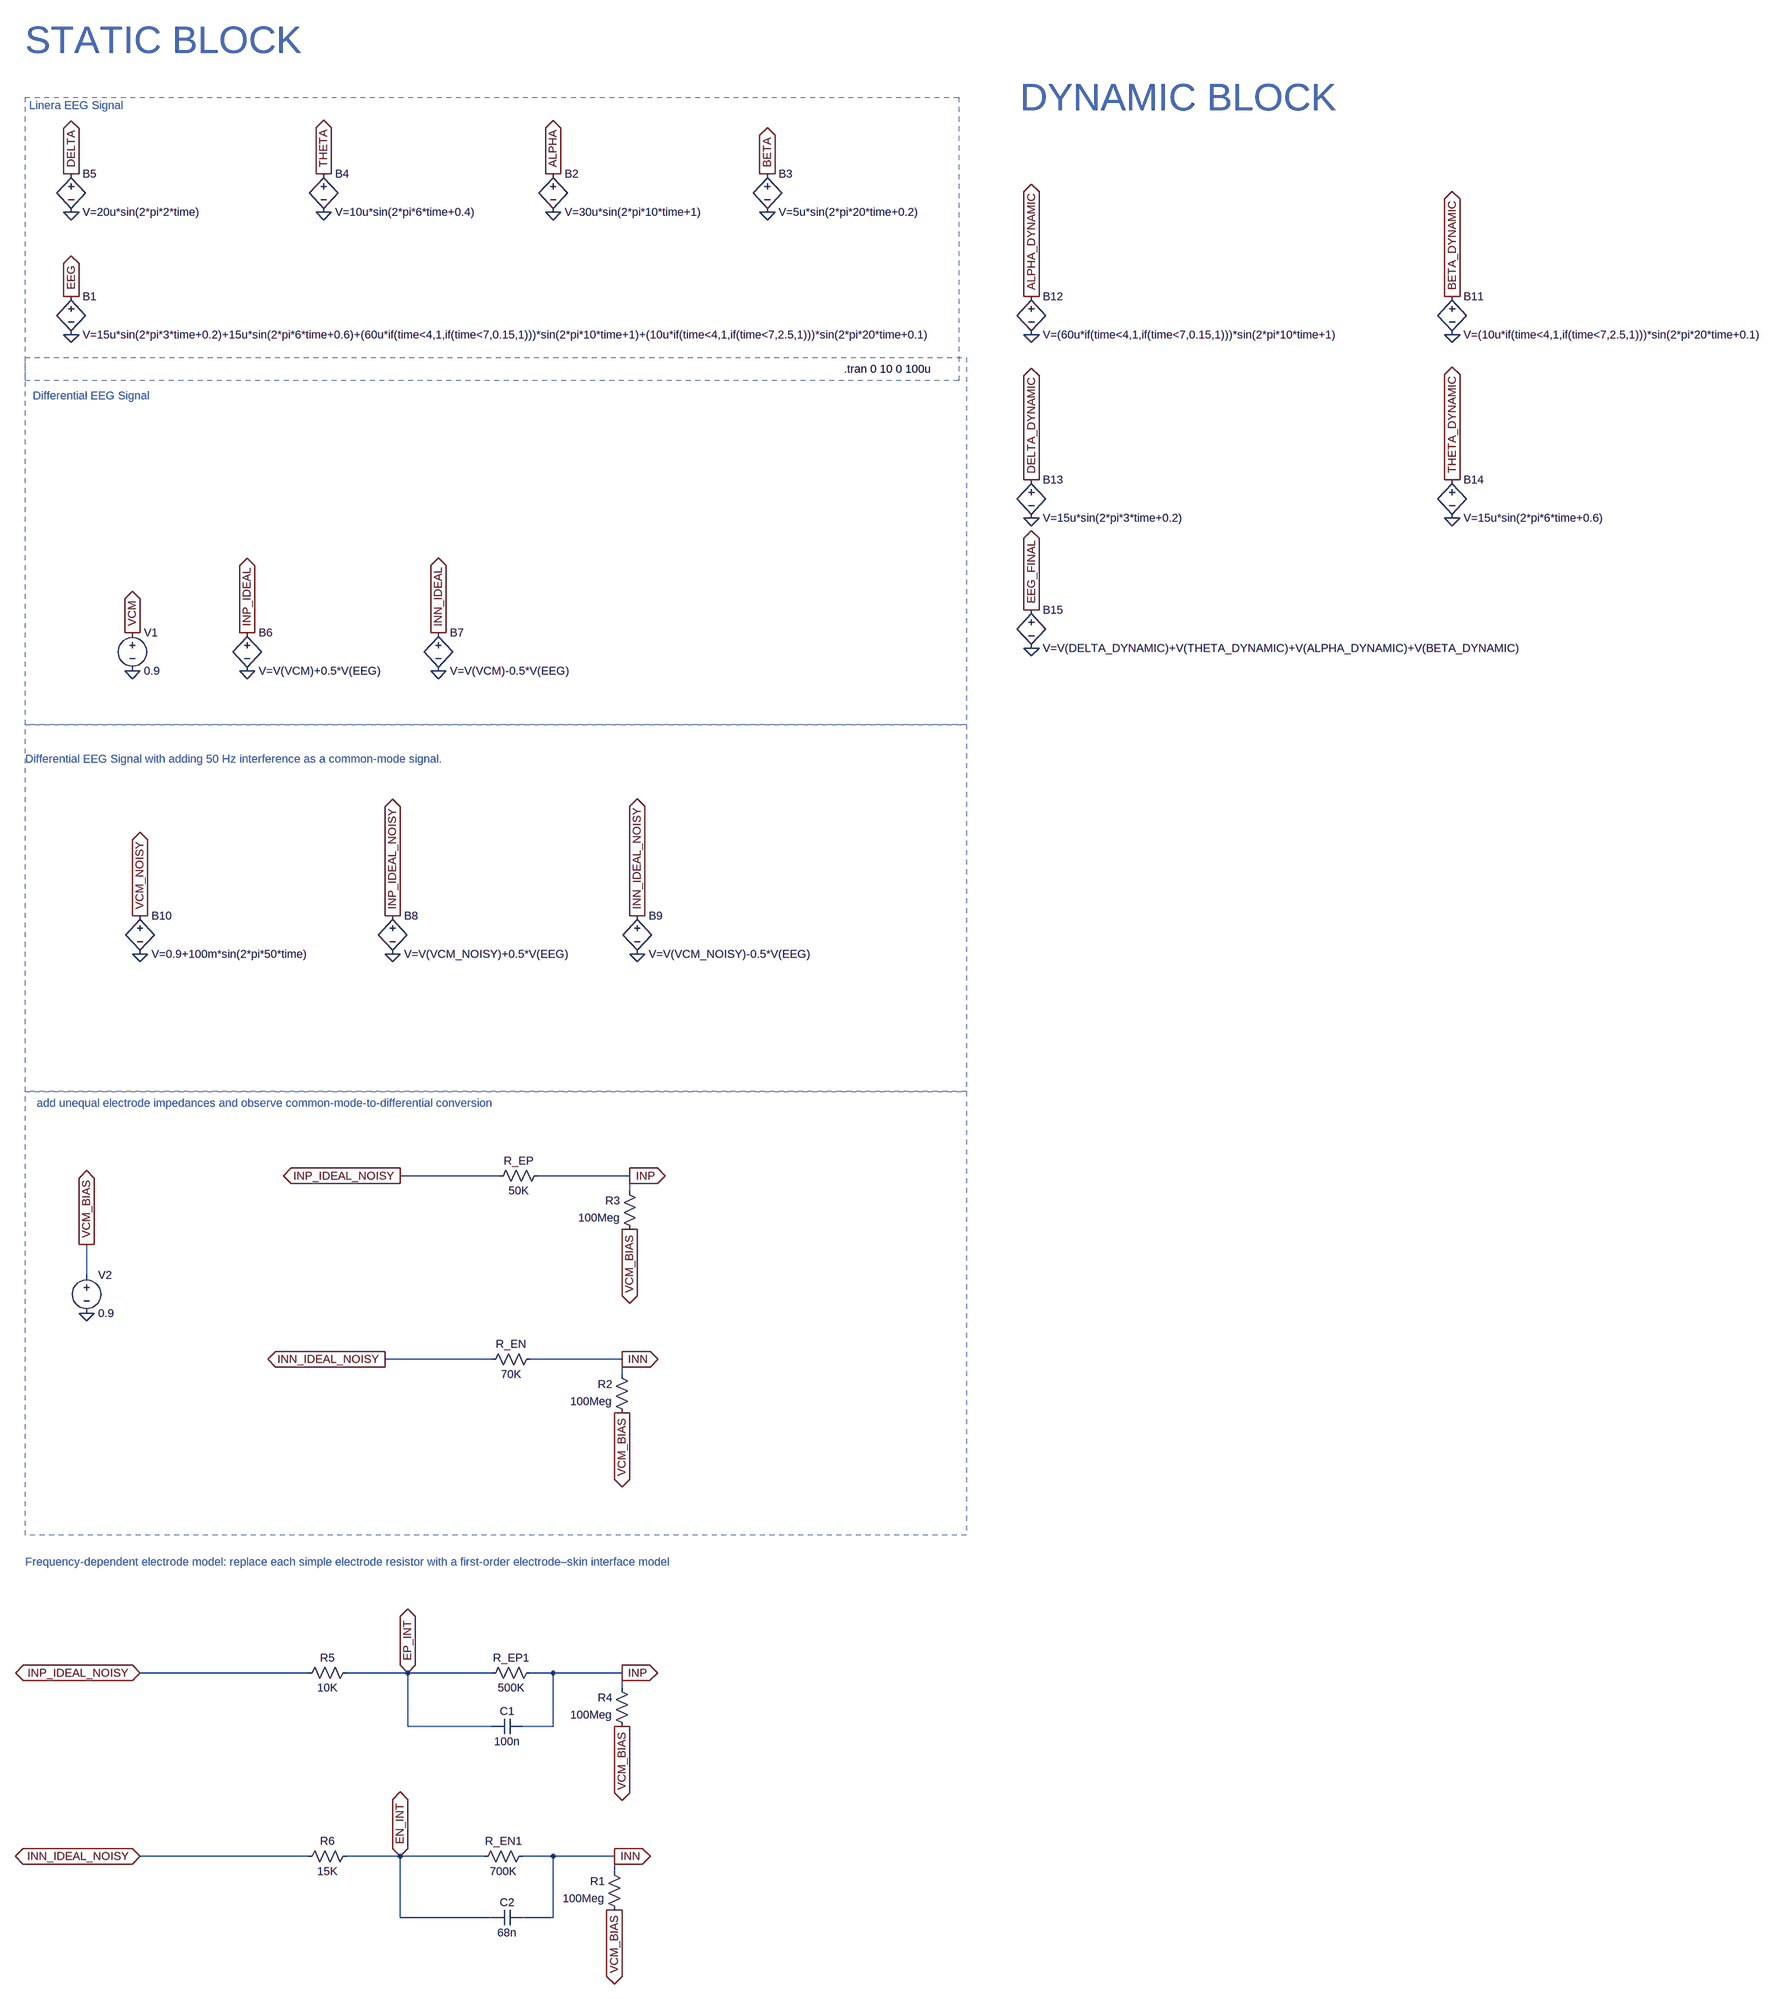
[diagram p0: schematic EEG_signal_generator.asc]
EEG_signal_generator.asc, the LTspice schematic file:
Version 4.1
SHEET 1 4440 3752
WIRE 80 2032 -128 2032
WIRE 352 2032 160 2032
WIRE 352 2064 352 2032
WIRE -784 2240 -784 2176
WIRE 64 2416 -160 2416
WIRE 336 2416 144 2416
WIRE 336 2448 336 2416
WIRE -320 3072 -672 3072
WIRE -112 3072 -240 3072
WIRE 64 3072 -112 3072
WIRE 192 3072 144 3072
WIRE 336 3072 192 3072
WIRE 336 3104 336 3072
WIRE -112 3184 -112 3072
WIRE 64 3184 -112 3184
WIRE 192 3184 192 3072
WIRE 192 3184 128 3184
WIRE -320 3456 -672 3456
WIRE -128 3456 -240 3456
WIRE 48 3456 -128 3456
WIRE 192 3456 128 3456
WIRE 320 3456 192 3456
WIRE 320 3488 320 3456
WIRE -128 3584 -128 3456
WIRE 64 3584 -128 3584
WIRE 192 3584 192 3456
WIRE 192 3584 128 3584
FLAG -816 272 0
FLAG -816 192 EEG
IOPIN -816 192 Out
FLAG 192 16 0
FLAG 192 -64 ALPHA
IOPIN 192 -64 Out
FLAG 640 16 0
FLAG 640 -64 BETA
IOPIN 640 -64 Out
FLAG -288 16 0
FLAG -288 -64 THETA
IOPIN -288 -64 Out
FLAG -816 16 0
FLAG -816 -64 DELTA
IOPIN -816 -64 Out
FLAG -688 976 0
FLAG -688 896 VCM
IOPIN -688 896 Out
FLAG -448 976 0
FLAG -448 896 INP_IDEAL
IOPIN -448 896 Out
FLAG -48 976 0
FLAG -48 896 INN_IDEAL
IOPIN -48 896 Out
FLAG -144 1568 0
FLAG -144 1488 INP_IDEAL_NOISY
IOPIN -144 1488 Out
FLAG 368 1568 0
FLAG 368 1488 INN_IDEAL_NOISY
IOPIN 368 1488 Out
FLAG -672 1568 0
FLAG -672 1488 VCM_NOISY
IOPIN -672 1488 Out
FLAG -128 2032 INP_IDEAL_NOISY
IOPIN -128 2032 Out
FLAG -160 2416 INN_IDEAL_NOISY
IOPIN -160 2416 Out
FLAG -784 2320 0
FLAG -784 2176 VCM_BIAS
IOPIN -784 2176 Out
FLAG 352 2032 INP
IOPIN 352 2032 Out
FLAG 336 2416 INN
IOPIN 336 2416 Out
FLAG 352 2144 VCM_BIAS
IOPIN 352 2144 Out
FLAG 336 2528 VCM_BIAS
IOPIN 336 2528 Out
FLAG -672 3072 INP_IDEAL_NOISY
IOPIN -672 3072 BiDir
FLAG -672 3456 INN_IDEAL_NOISY
IOPIN -672 3456 BiDir
FLAG 336 3072 INP
IOPIN 336 3072 Out
FLAG 320 3456 INN
IOPIN 320 3456 Out
FLAG 336 3184 VCM_BIAS
IOPIN 336 3184 Out
FLAG 320 3568 VCM_BIAS
IOPIN 320 3568 Out
FLAG -112 3072 EP_INT
IOPIN -112 3072 BiDir
FLAG -128 3456 EN_INT
IOPIN -128 3456 BiDir
FLAG 2304 272 0
FLAG 2304 192 ALPHA_DYNAMIC
IOPIN 2304 192 Out
FLAG 3184 272 0
FLAG 3184 192 BETA_DYNAMIC
IOPIN 3184 192 Out
FLAG 2304 656 0
FLAG 2304 576 DELTA_DYNAMIC
IOPIN 2304 576 Out
FLAG 3184 656 0
FLAG 3184 576 THETA_DYNAMIC
IOPIN 3184 576 Out
FLAG 2304 928 0
FLAG 2304 848 EEG_FINAL
IOPIN 2304 848 Out
SYMBOL bv -816 176 R0
SYMATTR InstName B1
SYMATTR Value V=15u*sin(2*pi*3*time+0.2)+15u*sin(2*pi*6*time+0.6)+(60u*if(time<4,1,if(time<7,0.15,1)))*sin(2*pi*10*time+1)+(10u*if(time<4,1,if(time<7,2.5,1)))*sin(2*pi*20*time+0.1)
SYMBOL bv 192 -80 R0
SYMATTR InstName B2
SYMATTR Value V=30u*sin(2*pi*10*time+1)
SYMBOL bv 640 -80 R0
SYMATTR InstName B3
SYMATTR Value V=5u*sin(2*pi*20*time+0.2)
SYMBOL bv -288 -80 R0
SYMATTR InstName B4
SYMATTR Value V=10u*sin(2*pi*6*time+0.4)
SYMBOL bv -816 -80 R0
SYMATTR InstName B5
SYMATTR Value V=20u*sin(2*pi*2*time)
SYMBOL voltage -688 880 R0
WINDOW 123 0 0 Left 0
WINDOW 39 0 0 Left 0
SYMATTR InstName V1
SYMATTR Value 0.9
SYMBOL bv -448 880 R0
SYMATTR InstName B6
SYMATTR Value V=V(VCM)+0.5*V(EEG)
SYMBOL bv -48 880 R0
SYMATTR InstName B7
SYMATTR Value V=V(VCM)-0.5*V(EEG)
SYMBOL bv -144 1472 R0
SYMATTR InstName B8
SYMATTR Value V=V(VCM_NOISY)+0.5*V(EEG)
SYMBOL bv 368 1472 R0
SYMATTR InstName B9
SYMATTR Value V=V(VCM_NOISY)-0.5*V(EEG)
SYMBOL bv -672 1472 R0
SYMATTR InstName B10
SYMATTR Value V=0.9+100m*sin(2*pi*50*time)
SYMBOL res 176 2016 R90
WINDOW 0 0 56 VBottom 2
WINDOW 3 32 56 VTop 2
SYMATTR InstName R_EP
SYMATTR Value 50K
SYMBOL res 160 2400 R90
WINDOW 0 0 56 VBottom 2
WINDOW 3 32 56 VTop 2
SYMATTR InstName R_EN
SYMATTR Value 70K
SYMBOL voltage -784 2224 R0
WINDOW 123 0 0 Left 0
WINDOW 39 0 0 Left 0
SYMATTR InstName V2
SYMATTR Value 0.9
SYMBOL res 352 2544 R180
WINDOW 0 36 76 Left 2
WINDOW 3 36 40 Left 2
SYMATTR InstName R2
SYMATTR Value 100Meg
SYMBOL res 368 2160 R180
WINDOW 0 36 76 Left 2
WINDOW 3 36 40 Left 2
SYMATTR InstName R3
SYMATTR Value 100Meg
SYMBOL res 160 3056 R90
WINDOW 0 0 56 VBottom 2
WINDOW 3 32 56 VTop 2
SYMATTR InstName R_EP1
SYMATTR Value 500K
SYMBOL res 144 3440 R90
WINDOW 0 0 56 VBottom 2
WINDOW 3 32 56 VTop 2
SYMATTR InstName R_EN1
SYMATTR Value 700K
SYMBOL res 336 3584 R180
WINDOW 0 36 76 Left 2
WINDOW 3 36 40 Left 2
SYMATTR InstName R1
SYMATTR Value 100Meg
SYMBOL res 352 3200 R180
WINDOW 0 36 76 Left 2
WINDOW 3 36 40 Left 2
SYMATTR InstName R4
SYMATTR Value 100Meg
SYMBOL res -224 3056 R90
WINDOW 0 0 56 VBottom 2
WINDOW 3 32 56 VTop 2
SYMATTR InstName R5
SYMATTR Value 10K
SYMBOL res -224 3440 R90
WINDOW 0 0 56 VBottom 2
WINDOW 3 32 56 VTop 2
SYMATTR InstName R6
SYMATTR Value 15K
SYMBOL cap 128 3168 R90
WINDOW 0 0 32 VBottom 2
WINDOW 3 32 32 VTop 2
SYMATTR InstName C1
SYMATTR Value 100n
SYMBOL cap 128 3568 R90
WINDOW 0 0 32 VBottom 2
WINDOW 3 32 32 VTop 2
SYMATTR InstName C2
SYMATTR Value 68n
SYMBOL bv 2304 176 R0
SYMATTR InstName B12
SYMATTR Value V=(60u*if(time<4,1,if(time<7,0.15,1)))*sin(2*pi*10*time+1)
SYMBOL bv 3184 176 R0
SYMATTR InstName B11
SYMATTR Value V=(10u*if(time<4,1,if(time<7,2.5,1)))*sin(2*pi*20*time+0.1)
SYMBOL bv 2304 560 R0
SYMATTR InstName B13
SYMATTR Value V=15u*sin(2*pi*3*time+0.2)
SYMBOL bv 3184 560 R0
SYMATTR InstName B14
SYMATTR Value V=15u*sin(2*pi*6*time+0.6)
SYMBOL bv 2304 832 R0
SYMATTR InstName B15
SYMATTR Value V=V(DELTA_DYNAMIC)+V(THETA_DYNAMIC)+V(ALPHA_DYNAMIC)+V(BETA_DYNAMIC)
TEXT 800 344 Left 2 !.tran 0 10 0 100u
TEXT -904 -208 Left 2 ;Linera EEG Signal
TEXT -896 400 Left 2 ;Differential EEG Signal
TEXT -912 1160 Left 2 ;Differential EEG Signal with adding 50 Hz interference as a common-mode signal.
TEXT -888 1880 Left 2 ;add unequal electrode impedances and observe common-mode-to-differential conversion
TEXT -912 2840 Left 2 ;Frequency-dependent electrode model: replace each simple electrode resistor with a first-order electrode–skin interface model
TEXT 2280 -224 Left 6 ;DYNAMIC BLOCK
TEXT -912 -344 Left 6 ;STATIC BLOCK
RECTANGLE Normal 1040 368 -912 -224 2
RECTANGLE Normal 1056 1088 -912 320 2
RECTANGLE Normal 1056 1856 -912 1088 2
RECTANGLE Normal 1056 2784 -912 1856 2

The netlist it stands for:
* EEG_signal_generator.asc
B1 EEG 0 V=15u*sin(2*pi*3*time+0.2)+15u*sin(2*pi*6*time+0.6)+(60u*if(time<4,1,if(time<7,0.15,1)))*sin(2*pi*10*time+1)+(10u*if(time<4,1,if(time<7,2.5,1)))*sin(2*pi*20*time+0.1)
B2 ALPHA 0 V=30u*sin(2*pi*10*time+1)
B3 BETA 0 V=5u*sin(2*pi*20*time+0.2)
B4 THETA 0 V=10u*sin(2*pi*6*time+0.4)
B5 DELTA 0 V=20u*sin(2*pi*2*time)
V1 VCM 0 0.9
B6 INP_IDEAL 0 V=V(VCM)+0.5*V(EEG)
B7 INN_IDEAL 0 V=V(VCM)-0.5*V(EEG)
B8 INP_IDEAL_NOISY 0 V=V(VCM_NOISY)+0.5*V(EEG)
B9 INN_IDEAL_NOISY 0 V=V(VCM_NOISY)-0.5*V(EEG)
B10 VCM_NOISY 0 V=0.9+100m*sin(2*pi*50*time)
R_EP INP INP_IDEAL_NOISY 50K
R_EN INN INN_IDEAL_NOISY 70K
V2 VCM_BIAS 0 0.9
R2 VCM_BIAS INN 100Meg
R3 VCM_BIAS INP 100Meg
R_EP1 INP EP_INT 500K
R_EN1 INN EN_INT 700K
R1 VCM_BIAS INN 100Meg
R4 VCM_BIAS INP 100Meg
R5 EP_INT INP_IDEAL_NOISY 10K
R6 EN_INT INN_IDEAL_NOISY 15K
C1 INP EP_INT 100n
C2 INN EN_INT 68n
B12 ALPHA_DYNAMIC 0 V=(60u*if(time<4,1,if(time<7,0.15,1)))*sin(2*pi*10*time+1)
B11 BETA_DYNAMIC 0 V=(10u*if(time<4,1,if(time<7,2.5,1)))*sin(2*pi*20*time+0.1)
B13 DELTA_DYNAMIC 0 V=15u*sin(2*pi*3*time+0.2)
B14 THETA_DYNAMIC 0 V=15u*sin(2*pi*6*time+0.6)
B15 EEG_FINAL 0 V=V(DELTA_DYNAMIC)+V(THETA_DYNAMIC)+V(ALPHA_DYNAMIC)+V(BETA_DYNAMIC)
.tran 0 10 0 100u
* Linera EEG Signal
* Differential EEG Signal
* Differential EEG Signal with adding 50 Hz interference as a common-mode signal.
* add unequal electrode impedances and observe common-mode-to-differential conversion
* Frequency-dependent electrode model: replace each simple electrode resistor with a first-order electrode–skin interface model
* DYNAMIC BLOCK
* STATIC BLOCK
.backanno
.end

* Results of the author's LTspice run, read from the files saved beside the schematic
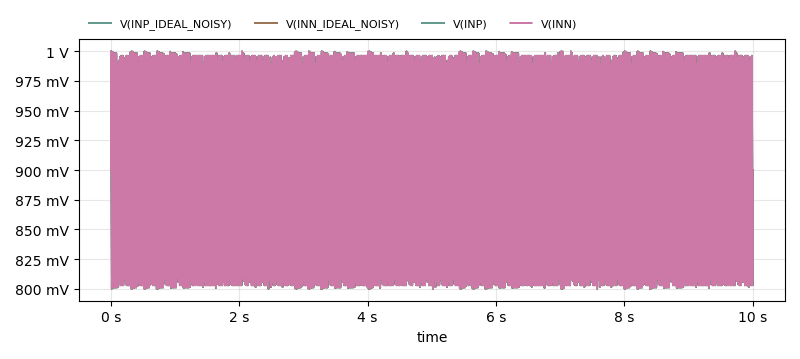
[diagram p1: Transient Analysis of EEG_signal_generator.asc, plotted from the saved traces]
* Transient Analysis, 1 run:
*   V(INP_IDEAL_NOISY): min 800 mV, max 1 V, average 899.9 mV, rms 902.6 mV, last 900 mV
*   V(INN_IDEAL_NOISY): min 800 mV, max 1 V, average 899.9 mV, rms 902.6 mV, last 900 mV
*   V(INP): min 800 mV, max 1 V, average 899.9 mV, rms 902.6 mV, last 900.1 mV
*   V(INN): min 800 mV, max 999.9 mV, average 899.9 mV, rms 902.6 mV, last 900 mV